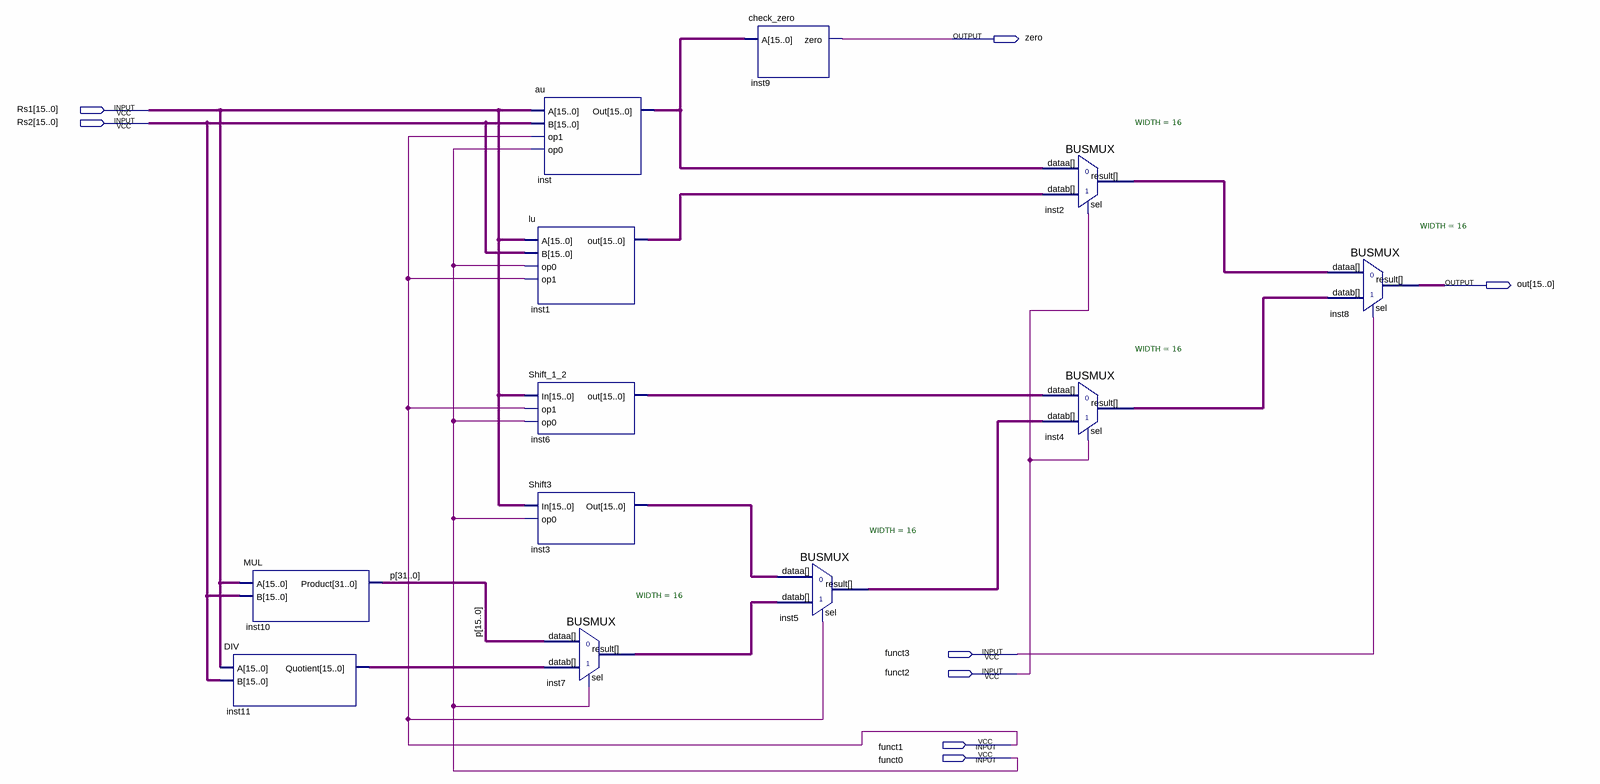
[diagram p0: schematic sheet]
// Quartus schematic alu.bdf as structural Verilog: 12 symbols, 8 pins
module alu (
  input  [15:0] Rs1,
  input  [15:0] Rs2,
  input  funct3,
  input  funct2,
  input  funct1,
  input  funct0,
  output zero,
  output [15:0] out
);

  wire [15:0] inst1_out, inst2_result, inst3_out, inst4_result, inst5_result, inst6_out, inst7_result,
       inst11_quotient, inst_out;
  wire [31:0] p;

  MUL inst10 (.A(Rs1), .B(Rs2), .Product(p));
  DIV inst11 (.A(Rs1), .B(Rs2), .Quotient(inst11_quotient));
  au inst (.A(Rs1), .B(Rs2), .op1(funct1), .op0(funct0), .Out(inst_out));
  lu inst1 (.A(Rs1), .B(Rs2), .op0(funct0), .op1(funct1), .out(inst1_out));
  Shift_1_2 inst6 (.In(Rs1), .op1(funct1), .op0(funct0), .out(inst6_out));
  Shift3 inst3 (.In(Rs1), .op0(funct0), .Out(inst3_out));
  BUSMUX #(.WIDTH(16)) inst7 (.datab(inst11_quotient), .sel(funct0), .dataa(p[15:0]), .result(inst7_result));
  check_zero inst9 (.A(inst_out), .zero(zero));
  BUSMUX #(.WIDTH(16)) inst5 (.datab(inst7_result), .sel(funct1), .dataa(inst3_out), .result(inst5_result));
  BUSMUX #(.WIDTH(16)) inst2 (.datab(inst1_out), .sel(funct2), .dataa(inst_out), .result(inst2_result));
  BUSMUX #(.WIDTH(16)) inst4 (.datab(inst5_result), .sel(funct2), .dataa(inst6_out), .result(inst4_result));
  BUSMUX #(.WIDTH(16)) inst8 (.datab(inst4_result), .sel(funct3), .dataa(inst2_result), .result(out));
endmodule
